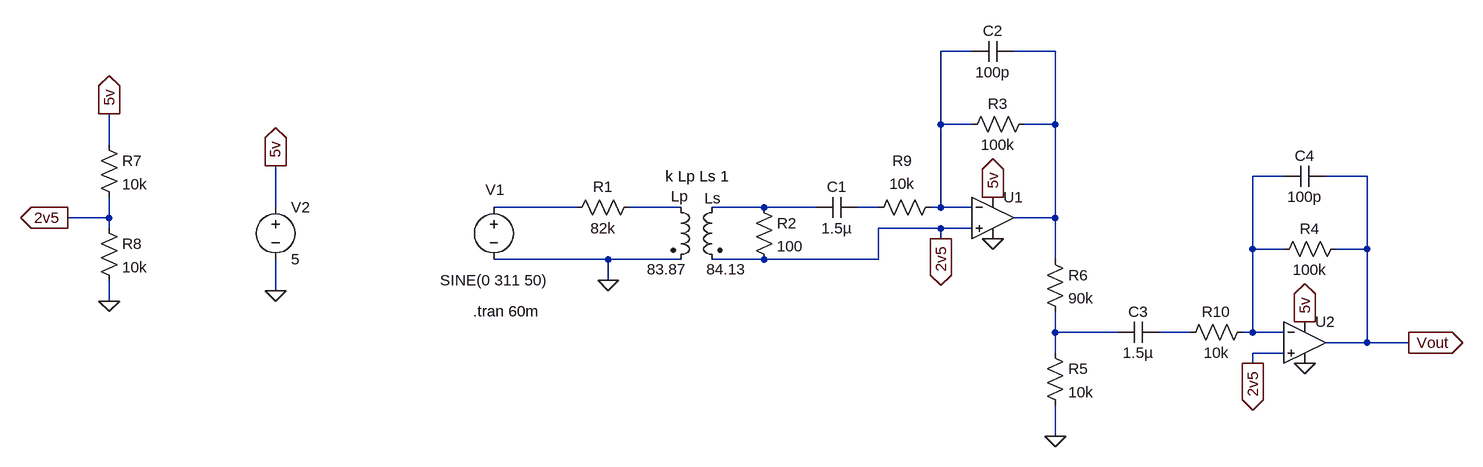
[diagram p0: schematic ZMPT101b.asc]
ZMPT101b.asc, the LTspice schematic file:
Version 4
SHEET 1 1328 680
WIRE 544 -128 496 -128
WIRE 672 -128 608 -128
WIRE 496 -16 496 -128
WIRE 544 -16 496 -16
WIRE 672 -16 672 -128
WIRE 672 -16 624 -16
WIRE -784 16 -784 -32
WIRE 1024 64 976 64
WIRE 1152 64 1088 64
WIRE -528 112 -528 48
WIRE -64 112 -192 112
WIRE 96 112 16 112
WIRE 224 112 144 112
WIRE 304 112 224 112
WIRE 400 112 368 112
WIRE 496 112 496 -16
WIRE 496 112 480 112
WIRE 544 112 496 112
WIRE -784 128 -784 96
WIRE -784 128 -848 128
WIRE 672 128 672 -16
WIRE 672 128 608 128
WIRE -784 144 -784 128
WIRE 496 144 400 144
WIRE 544 144 496 144
WIRE 496 160 496 144
WIRE 976 176 976 64
WIRE 1024 176 976 176
WIRE 1152 176 1152 64
WIRE 1152 176 1104 176
WIRE -16 192 -192 192
WIRE 96 192 -16 192
WIRE 224 192 144 192
WIRE 400 192 400 144
WIRE 400 192 224 192
WIRE 672 192 672 128
WIRE -16 224 -16 192
WIRE -528 240 -528 192
WIRE -784 256 -784 224
WIRE 672 304 672 272
WIRE 768 304 672 304
WIRE 880 304 832 304
WIRE 976 304 976 176
WIRE 976 304 960 304
WIRE 1024 304 976 304
WIRE 1152 320 1152 176
WIRE 1152 320 1088 320
WIRE 1216 320 1152 320
WIRE 672 336 672 304
WIRE 1024 336 976 336
WIRE 976 352 976 336
WIRE 672 464 672 416
FLAG -16 224 0
FLAG 672 464 0
FLAG 1056 352 0
FLAG 576 160 0
FLAG -528 48 5v
IOPIN -528 48 Out
FLAG -528 240 0
FLAG 576 96 5v
IOPIN 576 96 Out
FLAG 1056 288 5v
IOPIN 1056 288 Out
FLAG -784 256 0
FLAG -784 -32 5v
IOPIN -784 -32 Out
FLAG -848 128 2v5
IOPIN -848 128 Out
FLAG 496 160 2v5
IOPIN 496 160 Out
FLAG 976 352 2v5
IOPIN 976 352 Out
FLAG 1216 320 Vout
IOPIN 1216 320 Out
SYMBOL ind2 80 96 R0
WINDOW 0 1 -1 Left 2
WINDOW 3 -36 111 Left 2
SYMATTR InstName Lp
SYMATTR Value 83.87
SYMATTR Type ind
SYMATTR SpiceLine Rpar=1.655MEG
SYMBOL ind2 160 96 M0
WINDOW 0 2 2 Left 2
WINDOW 3 -36 111 Left 2
SYMATTR InstName Ls
SYMATTR Value 84.13
SYMATTR Type ind
SYMATTR SpiceLine Rpar=1.703MEG
SYMBOL res 32 96 R90
WINDOW 0 0 56 VBottom 2
WINDOW 3 32 56 VTop 2
SYMATTR InstName R1
SYMATTR Value 82k
SYMBOL voltage -192 96 R0
WINDOW 3 -83 128 Left 2
WINDOW 123 0 0 Left 0
WINDOW 39 0 0 Left 0
WINDOW 0 -13 -11 Left 2
SYMATTR Value SINE(0 311 50)
SYMATTR InstName V1
SYMBOL res 208 96 R0
SYMATTR InstName R2
SYMATTR Value 100
SYMBOL cap 368 96 R90
WINDOW 0 0 32 VBottom 2
WINDOW 3 32 32 VTop 2
SYMATTR InstName C1
SYMATTR Value 1.5µ
SYMBOL cap 608 -144 R90
WINDOW 0 0 32 VBottom 2
WINDOW 3 32 32 VTop 2
SYMATTR InstName C2
SYMATTR Value 100p
SYMBOL cap 832 288 R90
WINDOW 0 0 32 VBottom 2
WINDOW 3 32 32 VTop 2
SYMATTR InstName C3
SYMATTR Value 1.5µ
SYMBOL res 640 -32 R90
WINDOW 0 0 56 VBottom 2
WINDOW 3 32 56 VTop 2
SYMATTR InstName R3
SYMATTR Value 100k
SYMBOL res 1120 160 R90
WINDOW 0 0 56 VBottom 2
WINDOW 3 32 56 VTop 2
SYMATTR InstName R4
SYMATTR Value 100k
SYMBOL res 656 320 R0
SYMATTR InstName R5
SYMATTR Value 10k
SYMBOL res 656 176 R0
SYMATTR InstName R6
SYMATTR Value 90k
SYMBOL cap 1088 48 R90
WINDOW 0 0 32 VBottom 2
WINDOW 3 32 32 VTop 2
SYMATTR InstName C4
SYMATTR Value 100p
SYMBOL voltage -528 96 R0
WINDOW 123 0 0 Left 0
WINDOW 39 0 0 Left 0
SYMATTR InstName V2
SYMATTR Value 5
SYMBOL res -800 0 R0
SYMATTR InstName R7
SYMATTR Value 10k
SYMBOL res -800 128 R0
SYMATTR InstName R8
SYMATTR Value 10k
SYMBOL res 496 96 R90
WINDOW 0 -40 59 VBottom 2
WINDOW 3 -36 60 VTop 2
SYMATTR InstName R9
SYMATTR Value 10k
SYMBOL res 976 288 R90
WINDOW 0 0 56 VBottom 2
WINDOW 3 32 56 VTop 2
SYMATTR InstName R10
SYMATTR Value 10k
SYMBOL OpAmps\\UniversalOpAmp 1056 320 R0
SYMATTR InstName U2
SYMBOL OpAmps\\UniversalOpAmp 576 128 R0
SYMATTR InstName U1
TEXT 72 64 Left 2 !k Lp Ls 1
TEXT -224 272 Left 2 !.tran 60m

The netlist it stands for:
* ZMPT101b.asc
Lp N005 0 83.87 Rpar=1.655MEG
Ls N006 2v5 84.13 Rpar=1.703MEG
R1 N005 N004 82k
V1 N004 0 SINE(0 311 50)
R2 N006 2v5 100
C1 N007 N006 1.5µ
C2 N002 N001 100p
C3 N009 N008 1.5µ
R3 N002 N001 100k
R4 Vout N003 100k
R5 N008 0 10k
R6 N002 N008 90k
C4 Vout N003 100p
V2 5v 0 5
R7 5v 2v5 10k
R8 2v5 0 10k
R9 N001 N007 10k
R10 N003 N009 10k
XU2 2v5 N003 5v 0 Vout level1 Avol=1Meg GBW=10Meg Vos=0 En=0 Enk=0 In=0 Ink=0 Rin=500Meg  ; pins In+ In- V+ V- OUT
XU1 2v5 N001 5v 0 N002 level1 Avol=1Meg GBW=10Meg Vos=0 En=0 Enk=0 In=0 Ink=0 Rin=500Meg  ; pins In+ In- V+ V- OUT
k Lp Ls 1
.tran 60m
.lib UniversalOpAmp1.lib
.backanno
.end